# EAGLE design DispBat (EAGLE 6.6.0)
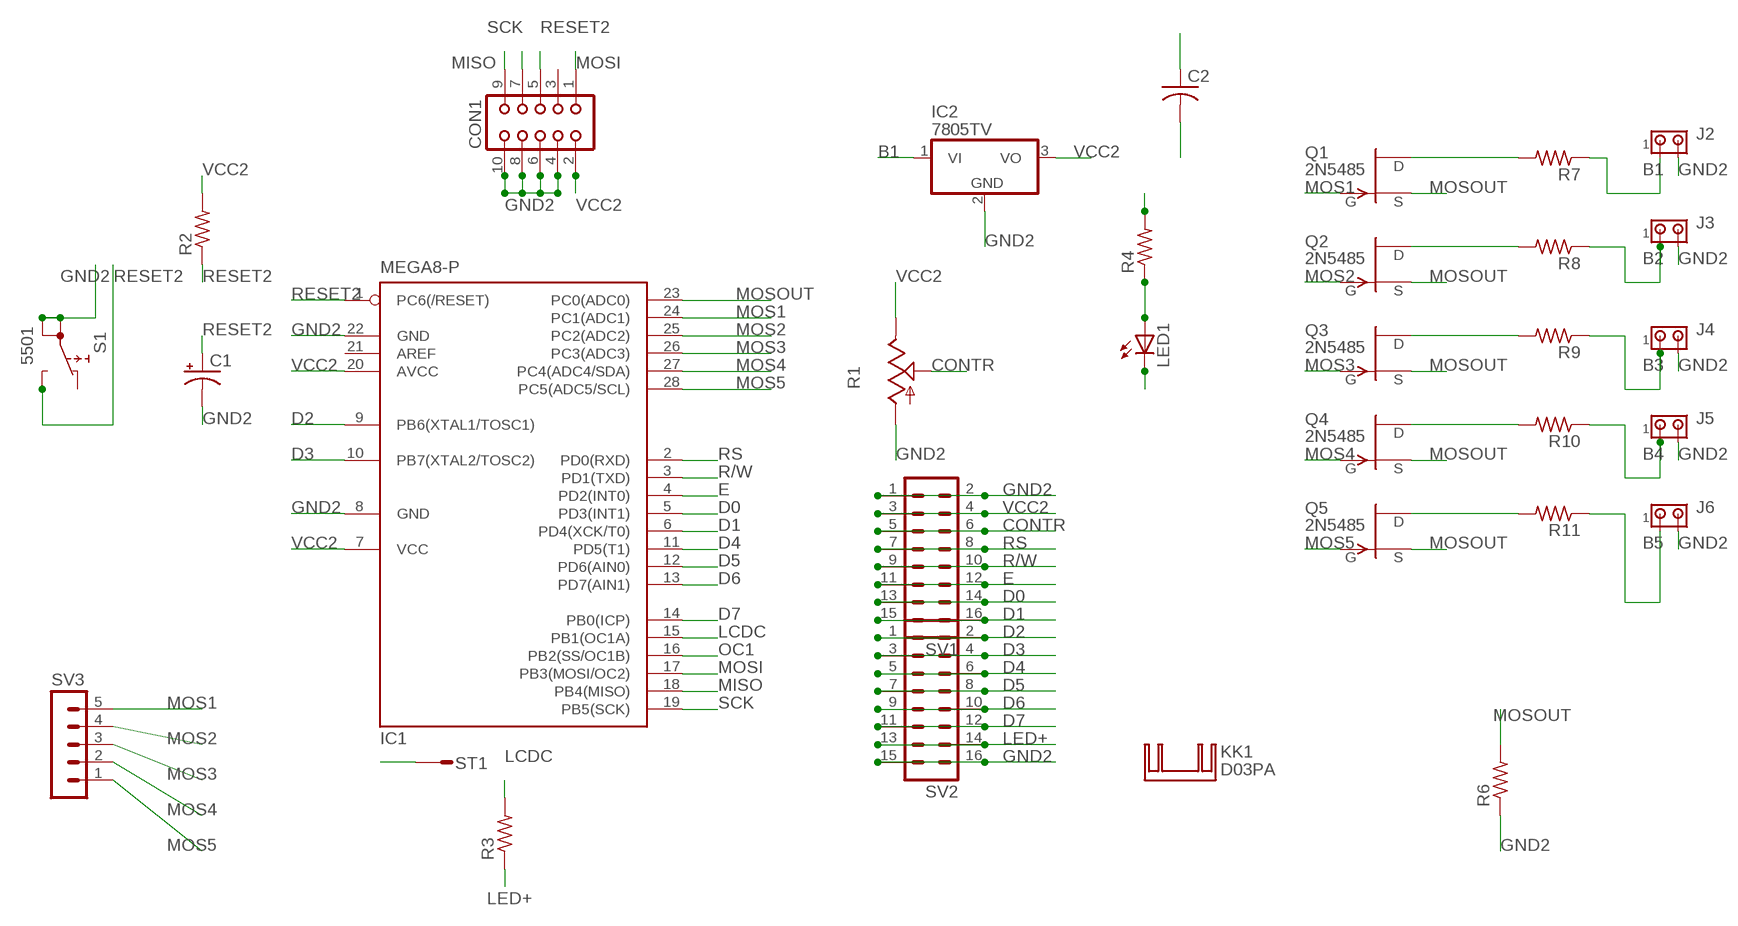
[diagram p0: schematic, sheet 1]

## Parts
C1  CPOL-USE2.5-7  [E2,5-7]
C2  C-US075-042X103  [C075-042X103]
CON1  CON10  [CON10]
IC1  MEGA8-P  [DIL28-3]
IC2  7805TV  [TO220V]
J2  MTA02-156  [1X2MTA]
J3  MTA02-156  [1X2MTA]
J4  MTA02-156  [1X2MTA]
J5  MTA02-156  [1X2MTA]
J6  MTA02-156  [1X2MTA]
KK1  D03PA  [D03PA]
LED1  LED_ELD260  [LED_LD260]
Q1  2N5485  [TO92-]
Q2  2N5485  [TO92-]
Q3  2N5485  [TO92-]
Q4  2N5485  [TO92-]
Q5  2N5485  [TO92-]
R1  TRIM_US-CA9V  [CA9V]
R2  R-US_0207/10  [0207/10]
R3  R-US_0207/10  [0207/10]
R4  R-US_0207/10  [0207/10]
R6  R-US_0207/10  [0207/10]
R7  R-US_0207/10  [0207/10]
R8  R-US_0207/10  [0207/10]
R9  R-US_0207/10  [0207/10]
R10  R-US_0207/10  [0207/10]
R11  R-US_0207/10  [0207/10]
S1  5501  [5501]
ST1  ST2,8  [ST2,8]
SV1  MA08-2  [MA08-2]
SV2  MA08-2  [MA08-2]
SV3  MA05-1  [MA05-1]

## Nets
B1: IC2.1(VI) J2.1 R7.1
B2: J3.1 R8.1
B3: J4.1 R9.1
B4: J5.1 R10.1
B5: J6.1 R11.1
CONTR: R1.S SV1.5 SV1.6
D0: IC1.5(PD3(INT1)) SV1.13 SV1.14
D1: IC1.6(PD4(XCK/T0)) SV1.15 SV1.16
D2: IC1.9(PB6(XTAL1/TOSC1)) SV2.1 SV2.2
D3: IC1.10(PB7(XTAL2/TOSC2)) SV2.3 SV2.4
D4: IC1.11(PD5(T1)) SV2.5 SV2.6
D5: IC1.12(PD6(AIN0)) SV2.7 SV2.8
D6: IC1.13(PD7(AIN1)) SV2.9 SV2.10
D7: IC1.14(PB0(ICP)) SV2.11 SV2.12
E: IC1.4(PD2(INT0)) SV1.11 SV1.12
GND2: C1.- C2.2 CON1.4 CON1.6 CON1.8 CON1.10 IC1.8(GND) IC1.22(GND) IC2.2(GND) J2.2 J3.2 J4.2 J5.2 J6.2 LED1.K(C) R1.A R6.1 S1.1A S1.1B SV1.1 SV1.2 SV2.15 SV2.16
LCDC: IC1.15(PB1(OC1A)) R3.2
LED+: R3.1 SV2.13 SV2.14
MISO: CON1.9 IC1.18(PB4(MISO))
MOS1: IC1.24(PC1(ADC1)) Q1.1(G) SV3.5
MOS2: IC1.25(PC2(ADC2)) Q2.1(G) SV3.4
MOS3: IC1.26(PC3(ADC3)) Q3.1(G) SV3.3
MOS4: IC1.27(PC4(ADC4/SDA)) Q4.1(G) SV3.2
MOS5: IC1.28(PC5(ADC5/SCL)) Q5.1(G) SV3.1
MOSI: CON1.1 IC1.17(PB3(MOSI/OC2))
MOSOUT: IC1.23(PC0(ADC0)) Q1.2(S) Q2.2(S) Q3.2(S) Q4.2(S) Q5.2(S) R6.2
N$2: LED1.A R4.1
N$8: Q1.3(D) R7.2
N$9: Q2.3(D) R8.2
N$10: Q3.3(D) R9.2
N$11: Q4.3(D) R10.2
N$12: Q5.3(D) R11.2
OC1: IC1.16(PB2(SS/OC1B)) ST1.1(ST)
R/W: IC1.3(PD1(TXD)) SV1.9 SV1.10
RESET2: C1.+ CON1.5 IC1.1(PC6(/RESET)) R2.1 S1.NO
RS: IC1.2(PD0(RXD)) SV1.7 SV1.8
SCK: CON1.7 IC1.19(PB5(SCK))
VCC2: C2.1 CON1.2 IC1.7(VCC) IC1.20(AVCC) IC2.3(VO) R1.E R2.2 R4.2 SV1.3 SV1.4
Unconnected: CON1.3 IC1.21(AREF) S1.NC

## Library data of the parts
C1 = rcl:CPOL-US: POLARIZED CAPACITOR, American symbol
C2 = rcl:C-US: CAPACITOR, American symbol
CON1 = con-harting:CON10: CONNECTOR; OC_FARNELL: unknown; OC_NEWARK: unknown
IC1 = atmel:MEGA8-P: MICROCONTROLLER 8 Kbytes FLASH, 1 kbytes SRAM, 512 bytes EEPROM, USART, 4-channel 10 bit ADC, 2-channel 8 bit ADC Pin compatible with Atmega48, ATMega88, ATMega168 Source: avr.lbr; OC_FARNELL: unknown; OC_NEWARK: unknown
IC2 = linear:78*: Positive VOLTAGE REGULATOR Source: http://cache.national.com/ds/LM/LM78L05.pdf http://www.fairchildsemi.com/ds/LM/LM7805.pdf
J2-J6 = con-amp:MTA02-156: AMP connector
KK1 = heatsink:D03PA: HEATSINK distributor Schukat
LED1 = eagle-ltspice:LED_E: LED Source: http://www.osram.convergy.de Source: www.luxeon.com Source: www.kingbright.com; SPICEMODEL: NONE; SPICEPREFIX: D; SPICETYPE: diode
Q1-Q5 = transistor-fet:?548*: N-Channel JFETs Source: VISHAY 2N5484.pdf Compatible: TO92 2N5245 J304 J305 U310 J308 J309 J310 TO72 2N4416 2N4416A 2N3823 2N4351 3N169 3N170 3N171 MFE3002 TO18 2N3796 2N3797 MFE825 Source: Motorola European Master Guide Pacge 3-59
R1 = pot:TRIM_US-: POTENTIOMETER
R2-R4 R6-R11 = rcl:R-US_: RESISTOR, American symbol
S1 = switch:55?: PUSHBUTTON SERIES 5500 SWITCHES Source: www.e-switch.com .. 5500.pdf
ST1 = con-rib:ST2,8: RIBBON CABLE CONNECTOR Flachstecker / Faston; OC_FARNELL: unknown; OC_NEWARK: unknown
SV1 SV2 = con-lstb:MA08-2: PIN HEADER; OC_FARNELL: unknown; OC_NEWARK: unknown
SV3 = con-lstb:MA05-1: PIN HEADER; OC_FARNELL: unknown; OC_NEWARK: unknown

## Net classes
0 default: width 1.016 mm, drill 0.61 mm, clearance 0.61 mm

## Board
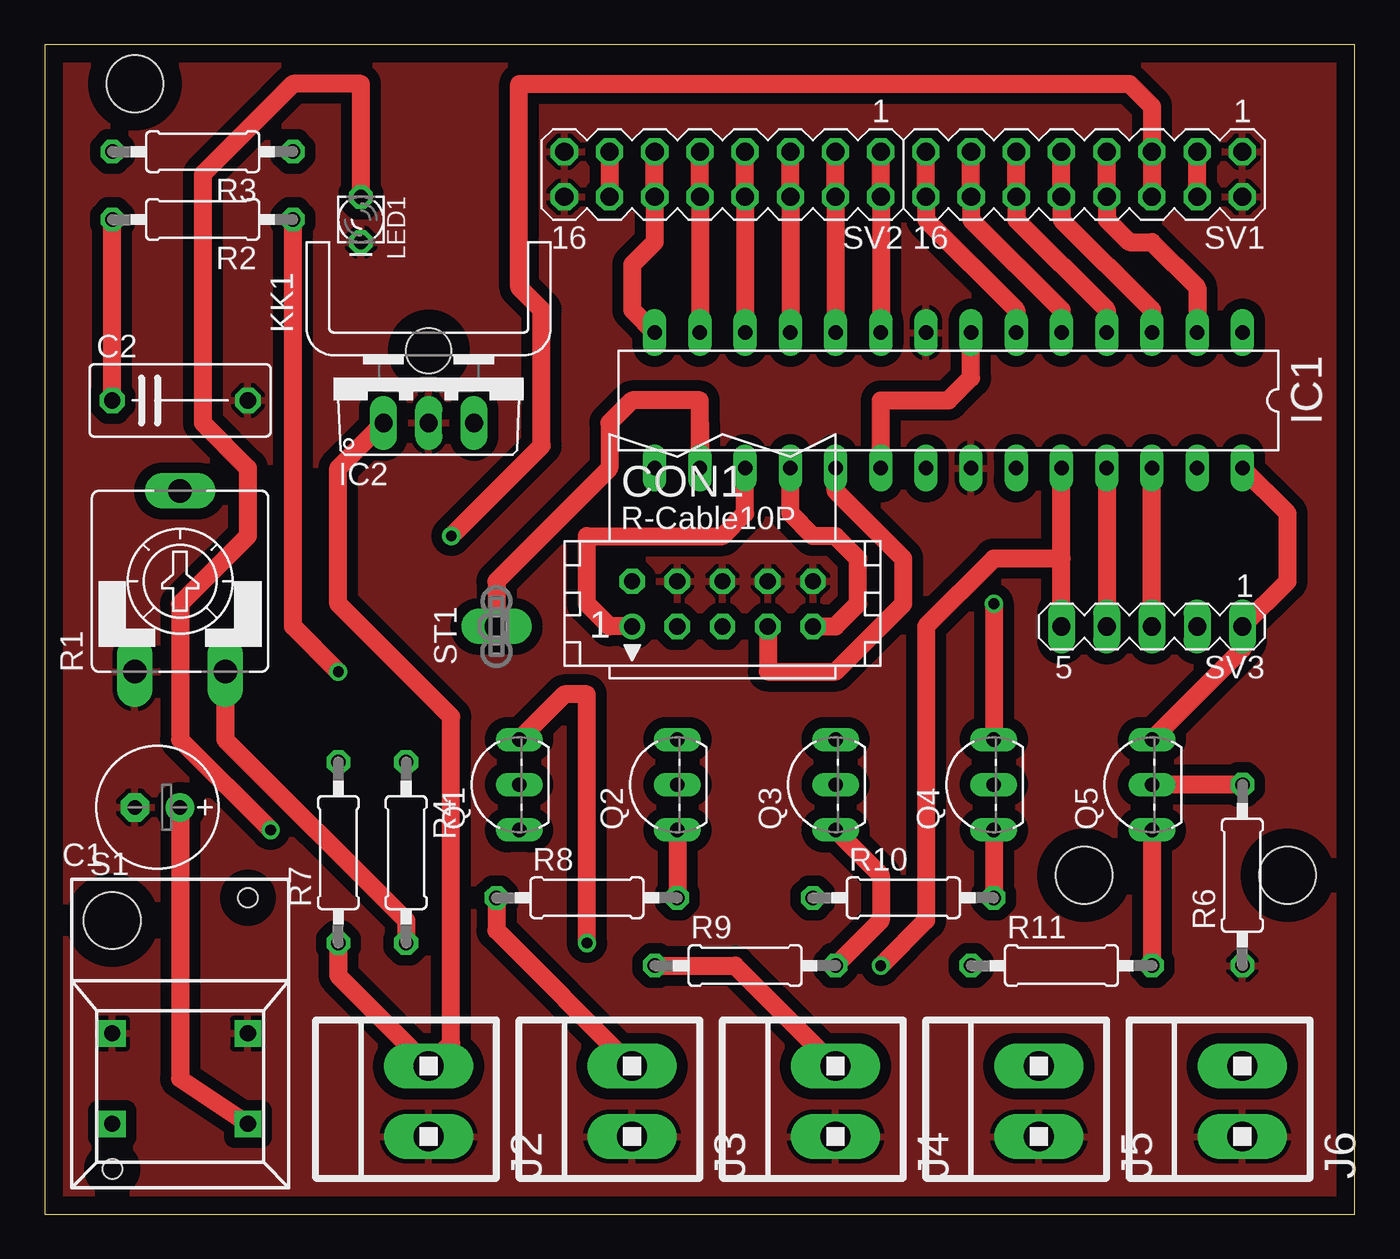
[diagram p1: board, top side]
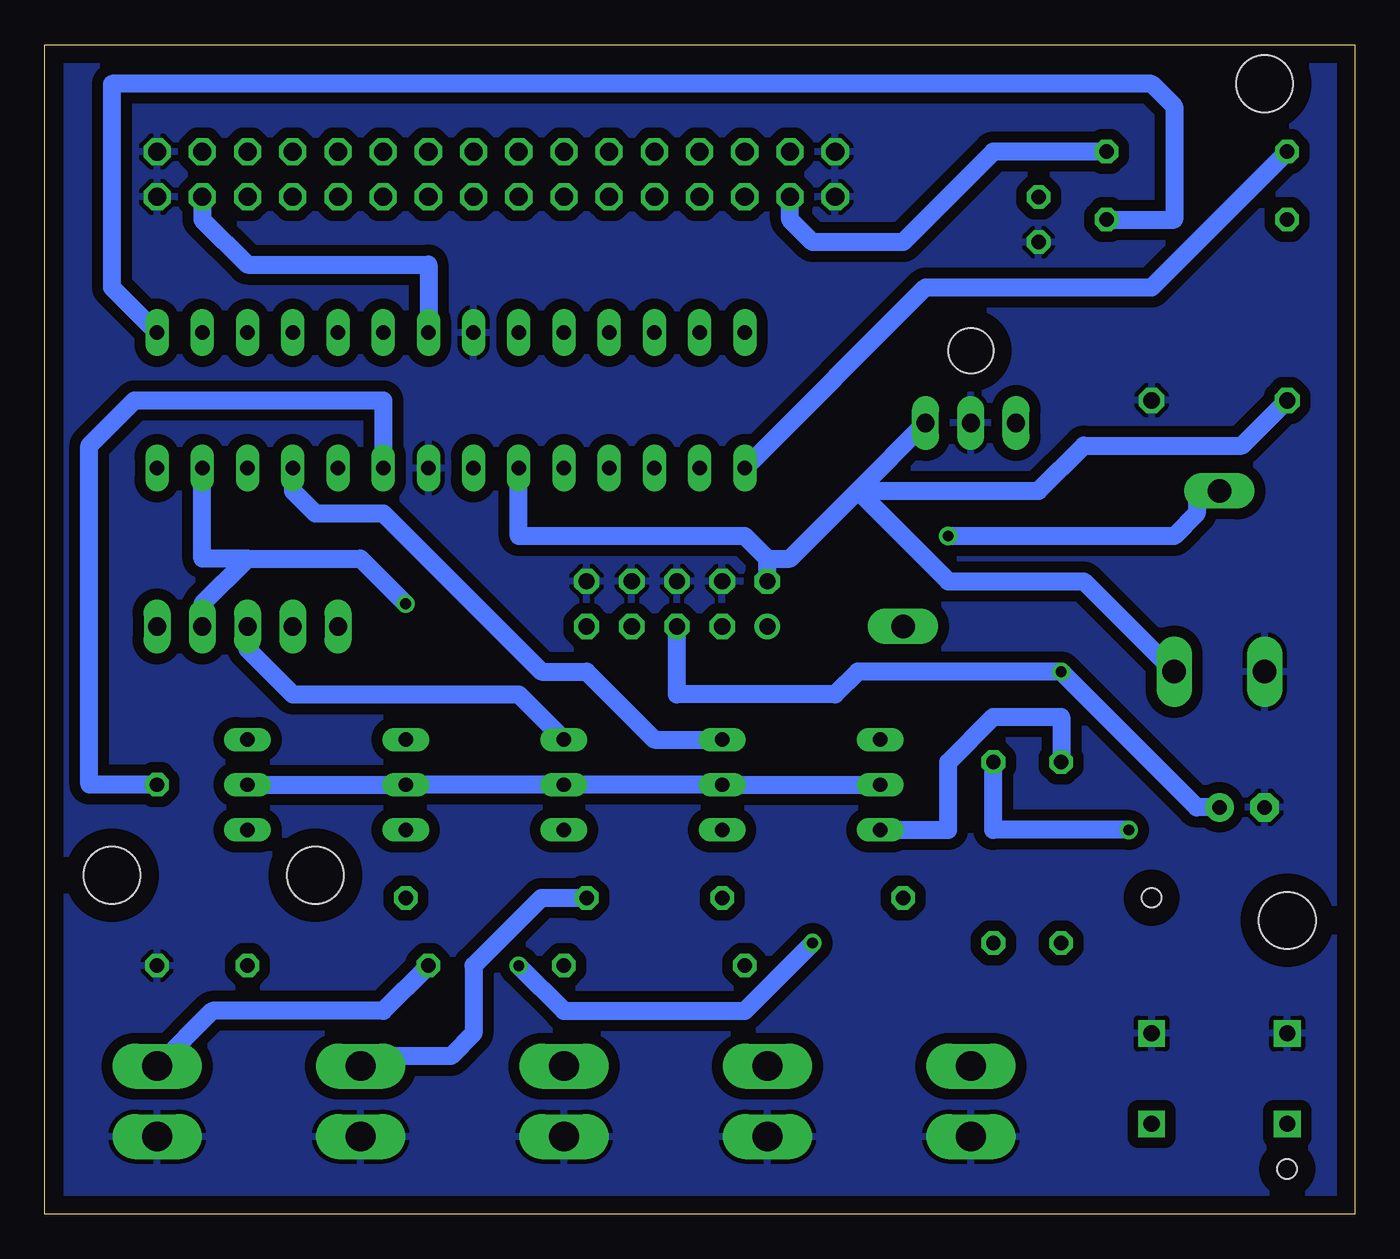
[diagram p2: board, bottom side, seen from below]

Size 73.64 x 65.71 mm. Coordinates in mm from the lower left corner, seen from the top.
Outline: 0,0 73.64,0 73.64,65.71 0,65.71 0,0
Copper layers (1*16): Top 0.035mm / dielectric 1.5mm / Bottom 0.035mm
Design rules "default": minimum track width 10mil, minimum drill 24mil, track to track 8mil, track to pad 8mil, pad to pad 8mil, via to via 8mil, smd to smd 8mil, copper to edge 40mil, drill to drill 8mil, minimum pad ring 10mil, minimum via ring 8mil, stop-mask expansion 4mil, vias tented up to drill 0mil, thermal gap 10mil
Holes 3.2 mm at 3.81,16.51 58.42,19.05 5.08,63.5 69.85,19.05

### Footprints (pad centres in the part's own frame; a part is rotated, then mirrored left to right if it is on the bottom)
E2,5-7 = drill 0.813 pad 1.6: + -1.27,0 | drill 0.813 pad 1.6 octagon: - 1.27,0
C075-042X103 = drill 0.914 octagon: 1 -3.81,0; 2 3.81,0
CON10 = drill 0.914: 1 -5.08,-1.27 | drill 0.914 octagon: 2 -5.08,1.27; 3 -2.54,-1.27; 4 -2.54,1.27; 5 0,-1.27; 6 0,1.27; 7 2.54,-1.27; 8 2.54,1.27; 9 5.08,-1.27; 10 5.08,1.27
DIL28-3 = drill 0.813 long: 1 -16.51,-3.81; 2 -13.97,-3.81; 3 -11.43,-3.81; 4 -8.89,-3.81; 5 -6.35,-3.81; 6 -3.81,-3.81; 7 -1.27,-3.81; 8 1.27,-3.81; 9 3.81,-3.81; 10 6.35,-3.81; 11 8.89,-3.81; 12 11.43,-3.81; 13 13.97,-3.81; 14 16.51,-3.81; 15 16.51,3.81; 16 13.97,3.81; 17 11.43,3.81; 18 8.89,3.81; 19 6.35,3.81; 20 3.81,3.81; 21 1.27,3.81; 22 -1.27,3.81; 23 -3.81,3.81; 24 -6.35,3.81; 25 -8.89,3.81; 26 -11.43,3.81; 27 -13.97,3.81; 28 -16.51,3.81
TO220V = drill 1.016 long: 1 -2.54,-2.54; 2 0,-2.54; 3 2.54,-2.54
1X2MTA = drill 1.676 long: 1 1.981,0; 2 -1.981,0
D03PA = hole 2.54: 0,-1.016
LED_LD260 = drill 0.813 octagon: A -1.27,0; K 1.27,0
TO92- = drill 0.813 long: 1 2.54,0; 2 0,0; 3 -2.54,0
CA9V = drill 1.321 long: A -2.54,-5.08; E 2.54,-5.08; S 0,5.08
0207/10 = drill 0.813 octagon: 1 -5.08,0; 2 5.08,0
5501 = drill 0.9 pad 1.5 square: 1A 0,3.81; 1B 0,-3.81; NC 5.08,-3.81; NO 5.08,3.81 | hole 1.1: -7.62,3.81; 7.62,-3.81
ST2,8 = drill 1.321 long: 1 0,0
MA08-2 = drill 1.016 octagon: 1 -8.89,-1.27; 2 -8.89,1.27; 3 -6.35,-1.27; 4 -6.35,1.27; 5 -3.81,-1.27; 6 -3.81,1.27; 7 -1.27,-1.27; 8 -1.27,1.27; 9 1.27,-1.27; 10 1.27,1.27; 11 3.81,-1.27; 12 3.81,1.27; 13 6.35,-1.27; 14 6.35,1.27; 15 8.89,-1.27; 16 8.89,1.27
MA05-1 = drill 1.016 long: 1 -5.08,0; 2 -2.54,0; 3 0,0; 4 2.54,0; 5 5.08,0

### Placement (x,y rotation side)
C1  6.35,22.86 180 top
C2  7.62,45.72 0 top
CON1  38.1,34.29 0 top
IC1  50.8,45.72 180 top
IC2  21.59,46.99 0 top
J2  21.59,6.35 90 top
J3  33.02,6.35 90 top
J4  44.45,6.35 90 top
J5  55.88,6.35 90 top
J6  67.31,6.35 90 top
KK1  21.59,49.53 0 top
LED1  17.78,55.88 270 top
Q1  26.67,24.13 90 top
Q2  35.56,24.13 90 top
Q3  44.45,24.13 90 top
Q4  53.34,24.13 90 top
Q5  62.23,24.13 90 top
R1  7.62,35.56 0 top
R2  8.89,55.88 180 top
R3  8.89,59.69 180 top
R4  20.32,20.32 270 top
R6  67.31,19.05 90 top
R7  16.51,20.32 90 top
R8  30.48,17.78 0 top
R9  39.37,13.97 0 top
R10  48.26,17.78 0 top
R11  57.15,13.97 0 top
S1  7.62,10.16 270 top
ST1  25.4,33.02 90 top
SV1  58.42,58.42 180 top
SV2  38.1,58.42 180 top
SV3  62.23,33.02 180 top

### Tracks (layer width: path | path; a pad name or v marks a point on that pad's centre or on a via)
B1
  Top 1.016: IC2.1 16.51,41.91 16.51,34.29 22.86,27.94 22.86,9.6 J2.1 16.51,13.41 R7.1
B2
  Top 1.016: R8.1 25.4,15.95 J3.1
B3
  Top 1.016: 44.45,7.62 J4.1 38.81,13.97 R9.1
B4
  Bottom 1.016: R10.1 45.72,17.78 49.53,13.97 49.53,10.16 50.8,8.89 55.88,8.89 J5.1
B5
  Bottom 1.016: R11.1 54.61,11.43 64.21,11.43 J6.1
CONTR  (via drill 0.61)
  Top 1.016: SV1.6 SV1.5 62.23,62.23 60.96,63.5 26.67,63.5 26.67,52.07 27.94,50.8 27.94,43.18 v22.86,38.1
  Bottom 1.016: v22.86,38.1 10.16,38.1 8.89,39.37 8.89,40.64 R1.S
D0
  Top 1.016: IC1.5 57.15,50.8 52.07,55.88 SV1.14 SV1.13
D1
  Top 1.016: IC1.6 54.61,50.8 49.53,55.88 SV1.16 SV1.15
D2
  Top 1.016: IC1.9 SV2.2 SV2.1
D3
  Top 1.016: IC1.10 SV2.4 SV2.3
D4
  Top 1.016: IC1.11 SV2.6 SV2.5
D5
  Top 1.016: IC1.12 SV2.8 SV2.7
D6
  Top 1.016: IC1.13 SV2.10 SV2.9
D7
  Top 1.016: IC1.14 33.02,50.8 33.02,53.34 34.29,54.61 SV2.12 SV2.11
E
  Top 1.016: IC1.4 59.69,50.8 54.61,55.88 SV1.12 SV1.11
GND2
  pour Top: 0,66.04 72.39,66.04 72.39,0 0,0
  pour Bottom: 0,66.04 72.39,66.04 72.39,0 0,0
LCDC
  Bottom 1.016: R3.2 11.43,52.07 24.13,52.07 IC1.15
LED+
  Top 1.016: SV2.13 SV2.14
  Bottom 1.016: R3.1 20.32,59.69 25.4,54.61 30.48,54.61 31.75,55.88 SV2.14
MISO
  Top 1.016: IC1.18 41.91,39.37 43.18,38.1 44.45,38.1 45.72,36.83 45.72,34.29 44.45,33.02 CON1.9
MOS1  (via drill 0.61)
  Top 1.016: Q1.1 29.21,29.21 30.48,29.21 v30.48,15.24 | v46.99,13.97 49.53,16.51 49.53,33.02 53.34,36.83 57.15,36.83 | SV3.5 57.15,36.83 | 57.15,36.83 IC1.24
  Bottom 1.016: v30.48,15.24 34.29,11.43 44.45,11.43 v46.99,13.97
MOS2
  Top 1.016: IC1.25 SV3.4
  Bottom 1.016: Q2.1 39.37,26.67 43.18,30.48 45.72,30.48 54.61,39.37 58.42,39.37 59.69,40.64 IC1.25
MOS3
  Top 1.016: SV3.3 IC1.26
  Bottom 1.016: Q3.1 46.99,29.21 59.69,29.21 62.23,31.75 SV3.3
MOS4  (via drill 0.61)
  Top 1.016: v53.34,34.29 Q4.1
  Bottom 1.016: v53.34,34.29 55.88,36.83 62.23,36.83 | 62.23,36.83 64.77,34.29 SV3.2 | IC1.27 64.77,36.83 62.23,36.83
MOS5
  Top 1.016: Q5.1 67.31,31.75 SV3.1 69.85,35.56 69.85,39.37 IC1.28
MOSI
  Top 1.016: IC1.17 39.37,39.37 38.1,38.1 30.48,38.1 30.48,34.29 31.75,33.02 CON1.1
MOSOUT
  Top 1.016: R6.2 Q5.2
  Bottom 1.016: Q1.2 Q2.2 Q3.2 Q4.2 Q5.2 | IC1.23 54.61,45.72 68.58,45.72 71.12,43.18 71.12,24.13 R6.2
N$2  (via drill 0.61)
  Top 1.016: v12.7,21.59 7.62,26.67 7.62,34.29 11.43,38.1 11.43,41.91 8.89,44.45 8.89,58.42 13.97,63.5 17.78,63.5 LED1.A
  Bottom 1.016: R4.1 20.32,21.59 v12.7,21.59
N$8
  Bottom 1.016: R7.2 16.51,27.94 20.32,27.94 22.86,25.4 22.86,21.59 Q1.3
N$9
  Top 1.016: Q2.3 R8.2
N$10
  Top 1.016: R9.2 46.99,16.51 46.99,19.05 Q3.3
N$11
  Top 1.016: Q4.3 R10.2
N$12
  Top 1.016: Q5.3 R11.2
OC1
  Top 1.016: 36.83,44.45 IC1.16 36.83,45.72 33.02,45.72 31.75,44.45 31.75,41.91 25.4,35.56 ST1.1
R/W
  Top 1.016: IC1.3 62.23,50.8 57.15,55.88 SV1.10 SV1.9
RESET2  (via drill 0.61)
  Top 1.016: R2.1 13.97,33.02 v16.51,30.48 | S1.NO 7.62,7.62 C1.+
  Bottom 1.016: C1.+ 8.89,22.86 v16.51,30.48 27.94,30.48 29.21,29.21 38.1,29.21 CON1.5 | R2.1 10.16,55.88 10.16,62.23 11.43,63.5 69.85,63.5 69.85,52.07 IC1.1
RS
  Top 1.016: IC1.2 64.77,52.07 62.23,54.61 60.96,54.61 59.69,55.88 SV1.8 SV1.7
SCK
  Top 1.016: IC1.19 44.45,40.64 48.26,36.83 48.26,34.29 44.45,30.48 40.64,30.48 CON1.7
VCC2
  Top 1.016: R4.2 20.32,16.51 10.16,26.67 R1.E | SV1.4 SV1.3 | C2.1 R2.2 | IC1.7 52.07,46.99 50.8,45.72 46.99,45.72 IC1.20
  Bottom 1.016: IC1.7 52.07,53.34 62.23,53.34 64.77,55.88 SV1.4 | IC1.20 46.99,38.1 34.29,38.1 33.02,36.83 | CON1.2 33.02,36.83 | 27.94,40.64 31.75,36.83 33.02,36.83 | 27.94,40.64 IC2.3 | C2.1 6.35,43.18 15.24,43.18 17.78,40.64 27.94,40.64 | R1.E 15.24,35.56 22.86,35.56 27.94,40.64

### Text on the board
tTest: (-) / L+ / D7 / D6 / D5 / D4 / D3 / D2 / D1 / D0 / E / RW / RS / CT / (+) / (-) | PC6 / PD0 / PD1 / PD2 / PD3 / PD4 / VCC / GND / PB6 / PB7 / PD5 / PD6 / PD7 / PB0 | PC1 / PC2 / PC3 / PC4 / PC5 | PB2 | RESET | VIN12